# Altium project HYLO Module Rev 1.PrjPcb (part 2 of 2)

## Sheet Power.SchDoc
size A4
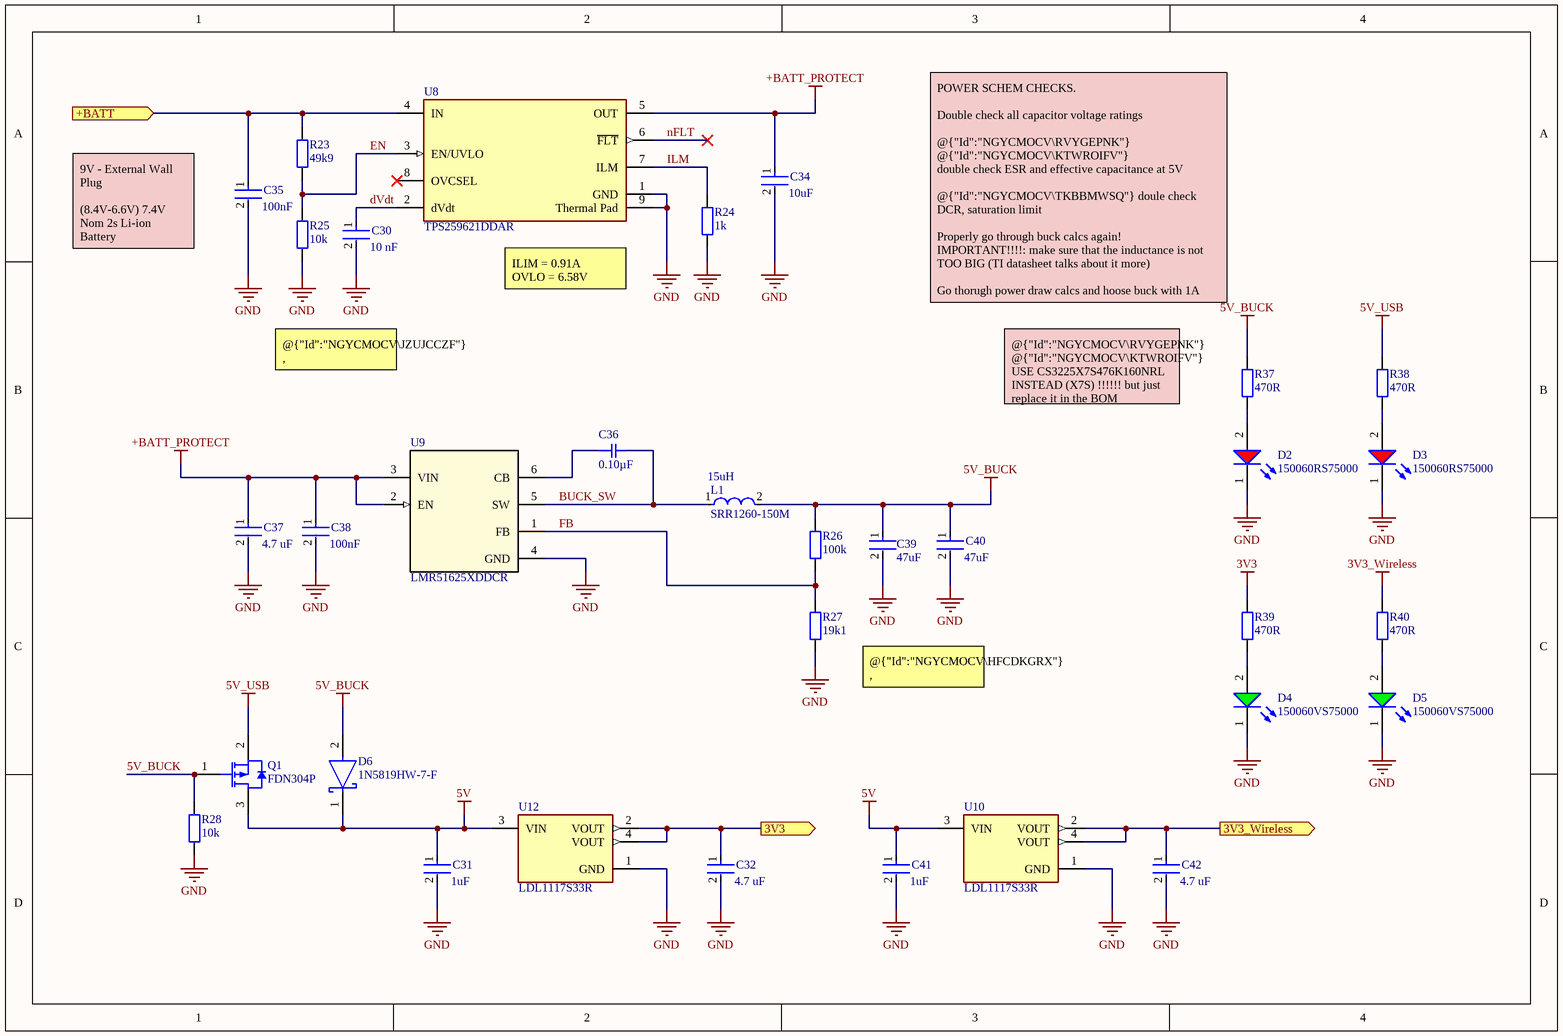
[diagram p6: Power.SchDoc]

### Parts
C30  value 10 nF  [FP-CC0402-MFG]  (hidden comment: CC0402KRX7R6BB103)
C31  Capacitance: 1uF  [FP-CL21-IPC_A]  (hidden comment: CL21B105KOFNNNE)
C32  value 4.7 uF  [FP-CC0805-0_85-MFG]  (hidden comment: CC0805KKX7R8BB475)
C34  Capacitance: 10uF  [FP-GRM21B-0_2-e0_2_0_7-MFG]  (hidden comment: GRM21BC71E106KE11L)
C35  Capacitance: 100nF  [FP-GRM155-0_05-MFG]  (hidden comment: GRM155R61E104KA87D)
C36  value 0.10µF  [SMD-0402C]  (hidden comment: GRM155R61A104KA01J)
C37  value 4.7 uF  [FP-CC0805-0_85-MFG]  (hidden comment: CC0805KKX7R8BB475)
C38  Capacitance: 100nF  [FP-GRM155-0_05-MFG]  (hidden comment: GRM155R61E104KA87D)
C39  Capacitance: 47uF  [FP-GRM32E-0_3-0_2-IPC_C]  (hidden comment: GRM32ER61C476KE15L)
C40  Capacitance: 47uF  [FP-GRM32E-0_3-0_2-IPC_C]  (hidden comment: GRM32ER61C476KE15L)
C41  Capacitance: 1uF  [FP-CL21-IPC_A]  (hidden comment: CL21B105KOFNNNE)
C42  value 4.7 uF  [FP-CC0805-0_85-MFG]  (hidden comment: CC0805KKX7R8BB475)
D2  150060RS75000  [WL-SMCW_0603_150060xx75000]
D3  150060RS75000  [WL-SMCW_0603_150060xx75000]
D4  150060VS75000  [WL-SMCW_0603_150060xx75000]
D5  150060VS75000  [WL-SMCW_0603_150060xx75000]
D6  1N5819HW-7-F  [FP-SOD123-IPC_A]
L1  SRR1260-150M  Inductance: 15uH  [FP-SRR1260-MFG]
Q1  FDN304P  [FAIR-SSOT3L-3_V]
R23  value 49k9  [IPC C R0402 NO SILK]  (hidden comment: 49.9k 1%)
R24  value 1k  [IPC C R0402 NO SILK]  (hidden comment: 1k 1%)
R25  value 10k  [IPC C R0402 NO SILK]  (hidden comment: 10k 1%)
R26  value 100k  [IPC C R0402 NO SILK]  (hidden comment: 100k 1%)
R27  value 19k1  [IPC C R0402 NO SILK]  (hidden comment: 19.1k 1%)
R28  10k  [IPC C R0402 NO SILK]
R37  470R  [IPC C R0402 NO SILK]
R38  470R  [IPC C R0402 NO SILK]
R39  470R  [IPC C R0402 NO SILK]
R40  470R  [IPC C R0402 NO SILK]
U8  TPS259621DDAR  [FP-DDA0008J-IPC_A]
U9  LMR51625XDDCR  [DDC0006A-MFG]
U10  LDL1117S33R  [FP-SOT223-0046067-IPC_C]
U12  LDL1117S33R  [FP-SOT223-0046067-IPC_C]

### Ports
3V3 (out), 3V3_Wireless (out), +BATT (in)

### Nets
3V3: C32.1 R39.1 U12.2(VOUT) U12.4(VOUT) ; port 3V3
3V3_Wireless: C42.1 R40.1 U10.2(VOUT) U10.4(VOUT) ; port 3V3_Wireless
5V: C31.1 C41.1 D6.1(C) Q1.3(DRAIN) U10.3(VIN) U12.3(VIN)
5V_BUCK: C39.1 C40.1 D6.2(A) L1.2 Q1.1(GATE) R26.2 R28.2 R37.1
5V_USB: Q1.2(SOURCE) R38.1
+BATT: C35.1 R23.2 U8.4(IN) ; port +BATT
+BATT_PROTECT: C34.1 C37.1 C38.1 U8.5(OUT) U9.2(EN) U9.3(VIN)
GND: C30.2 C31.2 C32.2 C34.2 C35.2 C37.2 C38.2 C39.2 C40.2 C41.2 C42.2 D2.1(K) D3.1(K) D4.1(K) D5.1(K) R24.1 R25.1 R27.2 R28.1 U8.1(GND) U8.9(Thermal_Pad) U9.4(GND) U10.1(GND) U12.1(GND)
BUCK_SW: C36.2 L1.1 U9.5(SW)
dVdt: C30.1 U8.2(dVdt)
EN: R23.1 R25.2 U8.3(EN/UVLO)
FB: R26.1 R27.1 U9.1(FB)
ILM: R24.2 U8.7(ILM)
nFLT: U8.6(~{FLT})
NetC36_1: C36.1 U9.6(CB)
NetD2_2: D2.2(A) R37.2
NetD3_2: D3.2(A) R38.2
NetD4_2: D4.2(A) R39.2
NetD5_2: D5.2(A) R40.2

Not connected (* = marked no-connect by the designer): U8 8(OVCSEL)*

### Notes on the sheet
- 9V - External Wall Plug
  (8.4V-6.6V) 7.4V Nom 2s Li-ion Battery
- (near U8) ILIM = 0.91A
  OVLO = 6.58V
- POWER SCHEM CHECKS.
  Double check all capacitor voltage ratings
  @{"Id":"NGYCMOCV\RVYGEPNK"} @{"Id":"NGYCMOCV\KTWROIFV"}
  double check ESR and effective capacitance at 5V
  @{"Id":"NGYCMOCV\TKBBMWSQ"} doule check DCR, saturation limit
  Properly go through buck calcs again!
  IMPORTANT!!!!: make sure that the inductance is not TOO BIG (TI datasheet talks about it more)
  Go thorugh power draw calcs and hoose buck with 1A output if def not going to exceed that
  @{"Id":"NGYCMOCV\LYMWLMJY"} increase current
- @{"Id":"NGYCMOCV\JZUJCCZF"} , @{"Id":"NGYCMOCV\VDXNOHQY"} , @{"Id":"NGYCMOCV\LYMWLMJY"} 1% 0402
- @{"Id":"NGYCMOCV\RVYGEPNK"} @{"Id":"NGYCMOCV\KTWROIFV"} USE CS3225X7S476K160NRL INSTEAD (X7S) !!!!!! but just replace it in the BOM
- (near R27) @{"Id":"NGYCMOCV\HFCDKGRX"} , @{"Id":"NGYCMOCV\USFXXWUM"} 1% 0402

### Library data of the parts
C30 = CMP-03422-000804-1: CAP CER 10000PF 10V X7R 0402; Manufacturer: YAGEO; Automotive Grade: NA; Material: Ceramic; Tolerance: 0.1; Temperature Coefficient: 30ppm/°C; Temperature Characteristic: X7R; Digikey Description: CAP CER 10000PF 10V X7R 0402; Footprint Url: http://www.yageo.com/exep/pages/download/literatures/UPY-C_GEN_24.pdf; Manufacturer Part Number: CC0402KRX7R6BB103; Category: Cap; RoHS: TRUE; Temperature Range Low: -55°C; Lead Free: Yes; ComponentLink2Description: Datasheet; Device Class L2: Capacitors; Temperature Range High: +125°C; Ipc Land Pattern Name: CAPC10050X50; Temperature: -55°C to +125°C; ComponentLink2URL: http://www.yageo.com/documents/recent/UPY-GP_NP0_16V-to-50V_16.pdf; Device Class L3: Ceramic Capacitors; Capacitance: 10 nF; Package: CC0402; Height: 0.55mm; Automotive: No; Octopart: https://octopart.com/cc0402krx7r6bb103-yageo-26721868; Mouser Description: Multilayer Ceramic Capacitors MLCC - SMD/SMT 10nF 10V X7R 10%; Device Class L1: Passive Components; Voltage Rating: 10 V
C31 C41 = CMP-13271-003098-1: CL21 Series 0805 1uF 16V ±10% Tolerance X7R Multilayer Ceramic Chip Capacitor; Case Code (Metric): 2012; Width: 0.049inch; Thickness: 0.053inch; Voltage Rating: 16V; Max Operating Temperature: 125°C; Case Code (Imperial): 0805; Height: 1.25mm; Length: 2mm; Case/Package: 0805; Lead Free: Lead Free; Mount: Surface Mount; Tolerance: 10%; Voltage Rating (DC): 16V; Min Operating Temperature: -55°C; Contact Plating: Tin; Depth: 1.25mm; Packaging: Tape and Reel; Package Quantity: 1; Voltage: 16V; Dielectric: X7R; Radiation Hardening: No
C32 C37 C42 = CMP-03422-000306-1: CAP CER 4.7UF 25V X7R 0805; Manufacturer: Yageo; Material: Ceramic; Tolerance: 0.1; ComponentLink2Description: Datasheet; Footprint Url: http://www.yageo.com/exep/pages/download/literatures/UPY-C_GEN_24.pdf; Temperature Range High: +85°C; Package: CC0805-0.85; Octopart: https://octopart.com/cc0805kkx7r8bb475-yageo-51849247; Mouser Description: Multilayer Ceramic Capacitors MLCC - SMD/SMT 4.7M pF 10% 25 Volts; Capacitance: 4.7 uF; Ipc Land Pattern Name: CAPC200125X85; Temperature: -30°C to +85°C; Digikey Description: CAP CER 4.7UF 25V X7R 0805; Temperature Characteristic: X7R; Temperature Range Low: -30°C; Lead Free: Yes; RoHS: TRUE; Device Class L3: Ceramic Capacitors; ComponentLink2URL: http://www.yageo.com/documents/recent/UPY-GPHC_Y5V_6.3V-to-50V_8.pdf; Category: Cap; Device Class L2: Capacitors; Manufacturer Part Number: CC0805KKX7R8BB475; Device Class L1: Passive Components; Height: 0.95mm; Automotive: No; Voltage Rating: 25 V
C34 = CMP-06035-039952-1: Chip Multilayer Ceramic Capacitors for General Purpose, 0805, 10uF, X7S, 22%, 10%, 25V; Dissipation Factor: 0.025%; Dielectric Material: Ceramic; Termination: SMD/SMT; Voltage: 25V; Weight: 0.000335oz; Min Operating Temperature: -55°C; Case Code (Metric): 2012; Depth: 1.25mm; Max Operating Temperature: 125°C; Dielectric: X7S; Length: 2mm; Voltage Rating (DC): 25V; Thickness: 0.057inch; Mount: Surface Mount; REACH SVHC: No SVHC; Width: 0.049inch; Case/Package: 0805; Case Code (Imperial): 0805; Voltage Rating: 25V; Height: 1.25mm; Lead Free: Lead Free; Package Quantity: 3000; Packaging: Tape and Reel; Tolerance: 10%
C35 C38 = CMP-2008-04580-2: CAP CER 0.1UF 25V X5R 0402; Lead/Base Style: Bayonet; Tolerance: 10%; Material: Ceramic; REACH SVHC: No SVHC; Voltage: 25V; Voltage Rating: 25V; Length: 1mm; Min Operating Temperature: -55°C; Case/Package: 0402; Width: 0.5mm; Termination: Standard; Series: GRM; Mount: Surface Mount; Thickness: 0.022inch; Lead Free: Lead Free; Voltage Rating (DC): 25V; Package Quantity: 10000; Weight: 0.000388oz; Height: 0.5mm; Case Code (Metric): 1005; RoHS Compliant: Yes; Packaging: Cut Tape; Depth: 0.5mm; Case Code (Imperial): 0402; Radiation Hardening: No; Max Operating Temperature: 85°C; Dielectric: X5R
C36 = CMP-140-000687-1: CAP CER 0.1UF 10V X5R 0402; Manufacturer: Murata Electronics North America; Factory Stock: 0; Unit Price (USD): 0.1; Minimum Quantity: 1; Tolerance: ±10%; Ratings: -; Lead Spacing: -; Source: capacitor_murata_0402$.SchLib; Part Status: Active; Pin Count: 2; Digi-Key Part Number: 490-6297-1-ND; Operating Temperature: -55°C ~ 85°C; Height - Seated (Max): -; Voltage: 10V; @ qty: 0; Temperature Coefficient: X5R; Package / Case: 0402 (1005 Metric); Size / Dimension: 0.039" L x 0.020" W (1.00mm x 0.50mm); Quantity Available: 24406; Datasheets: http://www.murata.com/~/media/webrenewal/support/library/catalog/products/capacitor/mlcc/c02e.pdf; Series: GRM; Applications: General Purpose; Thickness (Max): 0.022" (0.55mm); Image: //media.digikey.com/Renders/Murata%20Renders/ZRB-SERIES-0402.jpg; Packaging: Cut Tape (CT); Part Number: GRM155R61A104KA01J; Features: -; Component Type: Standard; Mounting Type: Surface Mount, MLCC; Design Item ID: GRM155R61A104KA01J
C39 C40 = CMP-2000-06362-2: CAP CER 47UF 16V X5R 1210; Tolerance: 10%; Material: Ceramic; Case Code (Metric): 3225; RoHS Compliant: Yes; Min Operating Temperature: -55°C; Radiation Hardening: No; Voltage: 16V; Package Quantity: 1; Case Code (Imperial): 1210; REACH SVHC: No SVHC; Voltage Rating (DC): 16V; Dielectric: X5R; Case/Package: 1210; Length: 3.2mm; Voltage Rating: 16V; Packaging: Cut Tape; Width: 0.098inch; Number of Pins: 2; Lead Free: Lead Free; Height: 2.5mm; Mount: Surface Mount; Termination: SMD/SMT; Max Operating Temperature: 85°C; Thickness: 0.106inch; Depth: 2.5mm
D2 D3 = CMP-1426-00001-4: LED Low-Power Uni-Color Red 630nm 2V 2-Pin Chip 0603(1608Metric) T/R; Max Junction Temperature (Tj): 95°C; Dominant Wavelength: 625nm; Lens Style: Clear, Rectangular; Viewing Angle: 140°; Forward Current: 100mA; Max Reverse Voltage (DC): 5V; Luminous Intensity: 250mcd; Test Current: 20mA; Power Dissipation: 72mW; Max Operating Temperature: 85°C; Mount: Surface Mount; Height: 700µm; Packaging: Tape and Reel; REACH SVHC: Unknown; Case Code (Metric): 1608; Peak Wavelength: 630nm; Forward Voltage: 2V; Case/Package: 0603; Color: Red; RoHS: Compliant; Width: 800µm; Reverse Voltage: 5V; Min Operating Temperature: -40°C; Wavelength: 625nm; Case Code (Imperial): 0603; Length: 1.6mm
D4 D5 = CMP-1426-00006-7: WURTH ELEKTRONIK - 150060VS75000 - LED, Green, SMD, 0603, 30 mA, 2 V, 570 nm; Reverse Voltage: 5V; Power Dissipation: 72mW; Dominant Wavelength: 570nm; Peak Wavelength: 572nm; Forward Current: 100mA; Forward Voltage: 2V; Lens Style: Clear, Rectangular; Test Current: 20mA; Max Junction Temperature (Tj): 95°C; Viewing Angle: 140°; Luminous Intensity: 40mcd; Height: 700µm; Width: 800µm; Length: 1.6mm; Mount: Surface Mount; Min Operating Temperature: -40°C; Max Reverse Voltage (DC): 5V; Case Code (Imperial): 0603; Wavelength: 570nm; Color: Green; REACH SVHC: Unknown; RoHS: Compliant; Max Operating Temperature: 85°C; Packaging: Tape and Reel; Case/Package: 0603; Number of Pins: 2; Case Code (Metric): 1608
D6 = CMP-0303-00003-3: DIODE SCHOTTKY 40V 1A SOD123; Forward Voltage: 450mV; Capacitance: 110pF; Max Forward Surge Current (Ifsm): 25A; Peak Reverse Current: 50uA; Polarity: Standard; Element Configuration: Single; Max Power Dissipation: 450mW; Min Operating Temperature: -65°C; Package Quantity: 3000; Contact Plating: Tin; Weight: 0.000353oz; Max Repetitive Reverse Voltage (Vrrm): 40V; Max Reverse Voltage (DC): 40V; Height: 1.25mm; Average Rectified Current: 1A; Width: 1.7mm; Case/Package: SOD-123-2; Lead Free: Lead Free; Max Operating Temperature: 125°C; Current Rating: 1A; Termination: SMD/SMT; Forward Current: 1A; Radiation Hardening: No; Number of Pins: 2; Length: 2.85mm; Voltage Rating (DC): 40V; REACH SVHC: No SVHC; Peak Non-Repetitive Surge Current: 25A; Packaging: Tape and Reel; Output Current: 1A
L1 = CMP-2000-07146-2: FIXED IND 15UH 5A 27 MOHM SMD; Q Factor: 25; Sample Rate (Hz): 100kHz; Resistance: 27MR; Material: Steel; Inductance Tolerance: 20%; Frequency: 17.6MHz; Saturation Current: 4.6A; Core Material: Ferrite; Shielding: Shielded; Series: SRR1260; Termination: SMD/SMT; Packaging: Tape and Reel; RoHS Compliant: Yes; Height - Seated (Max): 0.256inch; Depth: 12.8mm; Case/Package: 1260; Height: 6mm; Number of Pins: 2; Mount: Surface Mount; Min Operating Temperature: -40°C; Test Frequency: 100kHz; Length: 12.5mm; Self Resonant Frequency: 17.6MHz; Current Rating: 5A; Tolerance: 20%; RMS Current (Irms): 5A; REACH SVHC: No SVHC; Resistor Type: Wirewound; DC Resistance (DCR): 27mR; Width: 12.5mm; Package Quantity: 600; DC Current: 5A; Max DC Current: 5A; Max Operating Temperature: 125°C; Military Standard: Not
Q1 = CMP-2000-06247-1: P-Channel Specified Power Trench(R) MOSFET, 1.8 V, -55 to 150 degC, 3-Pin SSOT, RoHS, Tape and Reel; Manufacturer: Fairchild Semiconductor; Reel Quantity: 3000; Drain Source Voltage Vds: 20V; Power Dissipation Pd: 500mW; On Resistance Rds(on): 52mohm; Full Power Rating Temperature: 25°C; Voltage Vgs Max: -800mV; Pulse Current Idm: 10A; Rds(on) Test Voltage Vgs: -4.5V; External Depth: 2.5mm; Transistor Case Style: SOT-23; No. of Pins: 3; Continuous Drain Current Id: 2.4A; Voltage Vds Typ: -20V; Voltage Vgs th Max: -1.5V; Transistor Polarity: PChannel; Package Version: Rev. 3, 05/2015; External Width: 3.05mm; External Length / Height: 1.12mm; SMD Marking: 304P; SVHC: NoSVHC(19-Dec-2012); Termination Type: SMD; Datasheet URL: https://www.fairchildsemi.com/datasheets/FD/FDN304P.pdf; Tape Width: 8mm; Mounting Technology: SurfaceMount; Voltage Vgs Rds on Measurement: -4.5V; Operating Temperature Range: -55°Cto+150°C; Current Temperature: 25°C; Operating Temperature Min: -55°C; Threshold Voltage Vgs Typ: -800mV; Package / Case: SOT-23; Manufacturer URL: https://www.fairchildsemi.com/; Voltage Vds: 20V; Datasheet Version: Rev. C, 01/2001; Operating Temperature Max: 150°C; Package Description: 3-Pin Small Outline Transistor, Body 2.92 x 1.4 mm, Pitch 0.95 mm; Current Id Max: 2.4A; Package URL: https://www.fairchildsemi.com/package-drawings/MA/MA03B.pdf; Package Reference: SSOT3L
R23-R28 R37-R40 = CMP-009-00183-1: Design Item ID: Generic RES 0402; Source: Schlib1.SchLib
  R28: Value: 10k
  R37-R40: Value: 470R
U8 = CMP-04910-000076-1: 2.7-19V 130MA-2A SURGE CLAMPING
U9 = CMP-018-000009-1: SIMPLE SWITCHERÂ® synchronous buck converter with 4.3V-to-60V, 2.5A and low quiescent current 6-SOT-23-THIN -40 to 150; Manufacturer_Name: Texas Instruments; Copyright: Copyright (C) 2025 Ultra Librarian. All rights reserved.; Pin Count: 6; TYPE: TYPE; Design Item ID: LMR51625XDDCR; Manufacturer_Part_Number: LMR51625XDDCR; Source: LMR51625XDDCR.SchLib; Component Type: Standard; RefDes: RefDes
U10 U12 = CMP-12153-000006-1: IC REG LINEAR 3.3V 1.2A SOT223; Manufacturer: STMicroelectronics; Output Type: Fixed; Min Supply Voltage: 2.6V; Number Of Outputs: 1; Dropout Voltage: 350mV; Output Current: 2A; Nominal Supply Current: 250uA; Standoff Height: 0.02mm; Max Supply Voltage: 18V; Max Junction Temp: +125°C; Accuracy Percentage: 2%; Automotive: No; Device Class L2: Power Management ICs; Height: 1.9mm; Octopart: https://octopart.com/ldl1117s33r-stmicroelectronics-81876163; Output Voltage: 3.3V; Package: SOT223-0046067; Lead Free: Yes; Temperature Range Low: -40°C; Category: IC; Device Class L1: Integrated Circuits (ICs); Ipc Land Pattern Name: SOT230P700X190-4; Mouser Description: LDL1117 Series 1.2 A 3.3 V High PSRR LDO Linear Voltage Regulator-SOT-223; ComponentLink2Description: Datasheet; ComponentLink2URL: https://www.st.com/resource/en/datasheet/ldl1117.pdf; Device Class L3: Voltage Regulators - Linear; Manufacturer Part Number: LDL1117S33R; Temperature Range High: +125°C; Digikey Description: IC REG LINEAR 3.3V 1.2A SOT223; Temperature: -40°C to +125°C; RoHS: TRUE

## Nets that join several sheets
3V3: MCU (37 pins), U_IMU1 (C27_U_IMU1.1 C28_U_IMU1.1 U4_U_IMU1.5 U4_U_IMU1.8), U_IMU2 (C27_U_IMU2.1 C28_U_IMU2.1 U4_U_IMU2.5 U4_U_IMU2.8), U_IMU3 (C27_U_IMU3.1 C28_U_IMU3.1 U4_U_IMU3.5 U4_U_IMU3.8), U_IMU4 (C27_U_IMU4.1 C28_U_IMU4.1 U4_U_IMU4.5 U4_U_IMU4.8), Wireless+other (C29.1 U7.B1), Interface (J5.5 J6.5 J7.3 P1.1), Storage (9 pins), Power (C32.1 R39.1 U12.2 U12.4)
3V3_Wireless: Wireless+other (8 pins), Power (C42.1 R40.1 U10.2 U10.4)
5V_USB: Interface (5 pins), Power (Q1.2 R38.1)
+BATT: Top_level (J4.1), Power (C35.1 R23.2 U8.4)
GND: Top_level (J4.2 J4.3), MCU (31 pins), U_IMU1 (C27_U_IMU1.2 C28_U_IMU1.2 U4_U_IMU1.6 U4_U_IMU1.7), U_IMU2 (C27_U_IMU2.2 C28_U_IMU2.2 U4_U_IMU2.6 U4_U_IMU2.7), U_IMU3 (C27_U_IMU3.2 C28_U_IMU3.2 U4_U_IMU3.6 U4_U_IMU3.7), U_IMU4 (C27_U_IMU4.2 C28_U_IMU4.2 U4_U_IMU4.6 U4_U_IMU4.7), Wireless+other (9 pins), Interface (23 pins), Storage (8 pins), Power (24 pins)
BMI_MISO: MCU (R34.1), U_IMU1 (U4_U_IMU1.1), U_IMU2 (U4_U_IMU2.1), U_IMU3 (U4_U_IMU3.1), U_IMU4 (U4_U_IMU4.1)
BMI_MOSI: MCU (R35.1), U_IMU1 (U4_U_IMU1.14), U_IMU2 (U4_U_IMU2.14), U_IMU3 (U4_U_IMU3.14), U_IMU4 (U4_U_IMU4.14)
BMI_SCK: MCU (R29.1), U_IMU1 (U4_U_IMU1.13), U_IMU2 (U4_U_IMU2.13), U_IMU3 (U4_U_IMU3.13), U_IMU4 (U4_U_IMU4.13)
DWM_CS: MCU (U1.3), Wireless+other (R1.1)
DWM_EXTON: MCU (U1.22), Wireless+other (U13.1)
DWM_IRQ: MCU (U1.10), Wireless+other (U13.22)
DWM_MISO: MCU (U1.4), Wireless+other (R32.1)
DWM_MOSI: MCU (U1.5), Wireless+other (R33.1)
DWM_nRST: MCU (U1.20), Wireless+other (R30.1 U13.3)
DWM_RXLED: MCU (U1.13), Wireless+other (U13.13)
DWM_RXOKLED: MCU (U1.11), Wireless+other (U13.15)
DWM_SCK: MCU (U1.1), Wireless+other (R31.1)
DWM_SFDLED: MCU (U1.12), Wireless+other (U13.14)
DWM_SPIPHA: MCU (U1.18), Wireless+other (U13.9)
DWM_SPIPOL: MCU (U1.15), Wireless+other (U13.10)
DWM_SYNC: MCU (U1.19), Wireless+other (U13.4)
DWM_TXLED: MCU (U1.14), Wireless+other (U13.12)
DWM_WAKEUP: MCU (U1.21), Wireless+other (U13.2)
EEPROM_SCL: MCU (R7.2 U1.100), Wireless+other (U7.A2), Storage (U5.6)
EEPROM_SDA: MCU (R8.2 U1.99), Wireless+other (U7.B2), Storage (U5.5)
ESP_CH_PD: MCU (U1.49), Wireless+other (J3.3 R22.2)
ESP_IO0: MCU (U1.35), Wireless+other (J3.6)
ESP_IO2: MCU (U1.46), Wireless+other (J3.4)
ESP_nRST: MCU (U1.48), Wireless+other (J3.5 R21.2)
ESP_RXD: MCU (U1.36), Wireless+other (J3.8)
ESP_TXD: MCU (U1.37), Wireless+other (J3.1)
EXT_CS: MCU (U1.40), Interface (J6.1)
EXT_MISO: MCU (U1.42), Interface (J6.4)
EXT_MOSI: MCU (U1.43), Interface (J6.3)
EXT_RX: MCU (U1.59), Interface (J5.3)
EXT_SCK: MCU (U1.41), Interface (J6.2)
EXT_TX: MCU (U1.58), Interface (J5.4)
nRST: MCU (C15.1 SW1.1 U1.25), Interface (R19.2)
SD_CD: MCU (U1.128), Storage (J1.9 R6.1)
SD_CLK: MCU (U1.122), Storage (J1.5)
SD_CMD: MCU (U1.123), Storage (J1.3 R9.1)
SD_D0: MCU (U1.124), Storage (J1.7 R10.1)
SD_D1: MCU (U1.125), Storage (J1.8 R11.1)
SD_D2: MCU (U1.126), Storage (J1.1 R12.1)
SD_D3: MCU (U1.127), Storage (J1.2 R13.1)
SWCLK: MCU (U1.109), Interface (P1.3 R18.2)
SWDIO: MCU (U1.105), Interface (P1.2 R17.2)
SWO: MCU (U1.133), Interface (J7.8)
T_VCP_RX: MCU (U1.141), Interface (J7.13)
T_VCP_TX: MCU (U1.142), Interface (J7.14)
USART1_RX: MCU (U1.102), Interface (U2.8)
USART1_TX: MCU (U1.101), Interface (U2.9)

## Assembly variants
Anchor: all parts fitted